# EAGLE design manual-switch (EAGLE 7.6.0)
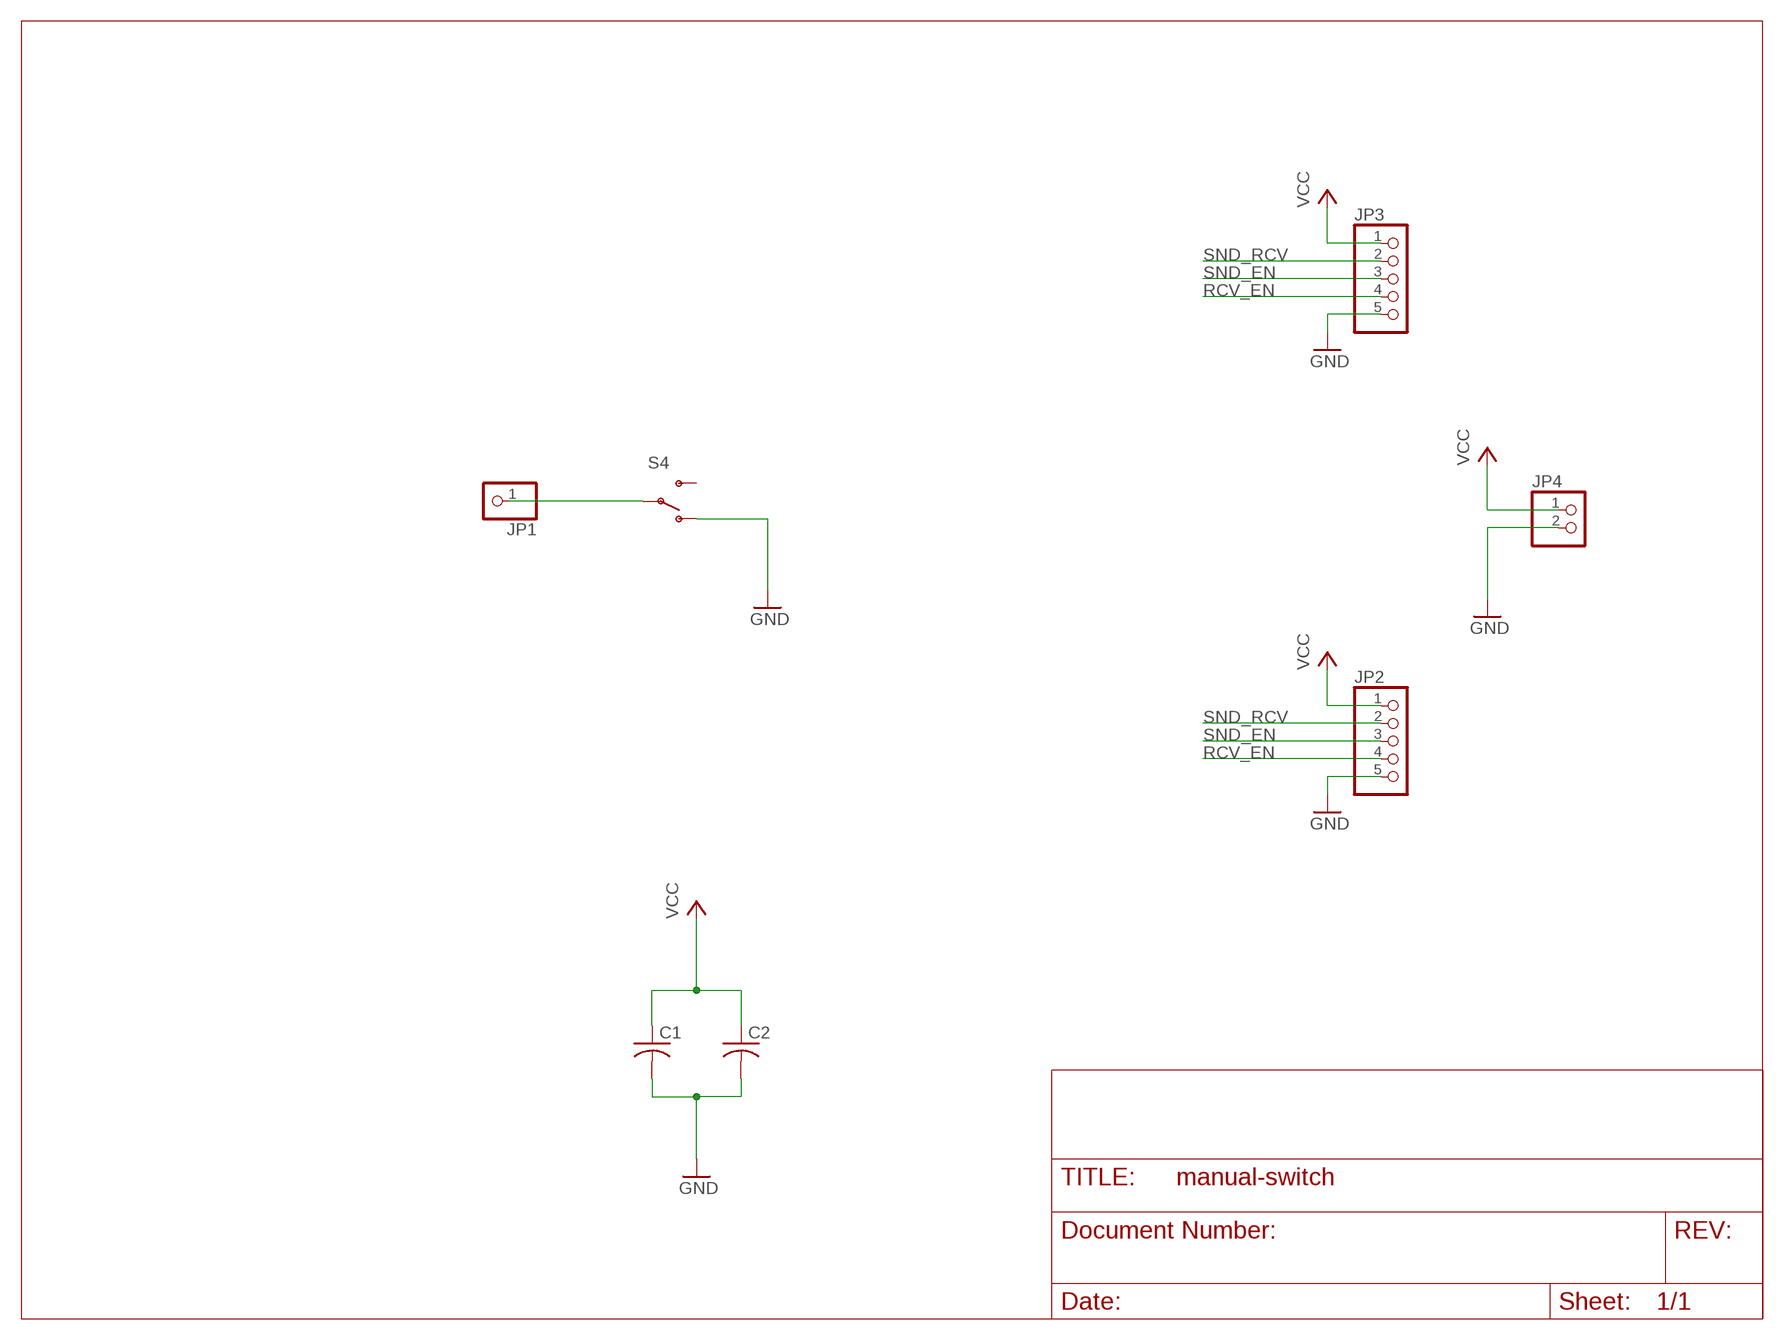
[diagram p0: schematic, sheet 1]

## Parts
C1  C-USC0805  [C0805]
C2  C-USC0805  [C0805]
JP1  PINHD-1X1  [1X01]
JP2  PINHD-1X5  [1X05]
JP3  PINHD-1X5  [1X05]
JP4  PINHD-1X2  [1X02]
S4  SWITCH-SPDTPTH  [SWITCH-SPDT]

## Nets
GND: C1.2 C2.2 JP2.5 JP3.5 JP4.2 S4.1(O)
N$1: JP1.1 S4.2(P)
RCV_EN: JP2.4 JP3.4
SND_EN: JP2.3 JP3.3
SND_RCV: JP2.2 JP3.2
VCC: C1.1 C2.1 JP2.1 JP3.1 JP4.1
Unconnected: S4.3(S)

## Library data of the parts
C1 C2 = resistor:C-US: CAPACITOR, American symbol
JP1 = pinhead:PINHD-1X1: PIN HEADER
JP2 JP3 = pinhead:PINHD-1X5: PIN HEADER
JP4 = pinhead:PINHD-1X2: PIN HEADER
S4 = SparkFun-Electromechanical:SWITCH-SPDT: SPDT Switch Simple slide switch, Spark Fun Electronics SKU : COM-00102 DPDT SMT slide switch, AYZ0202, SWCH-08179

## Board
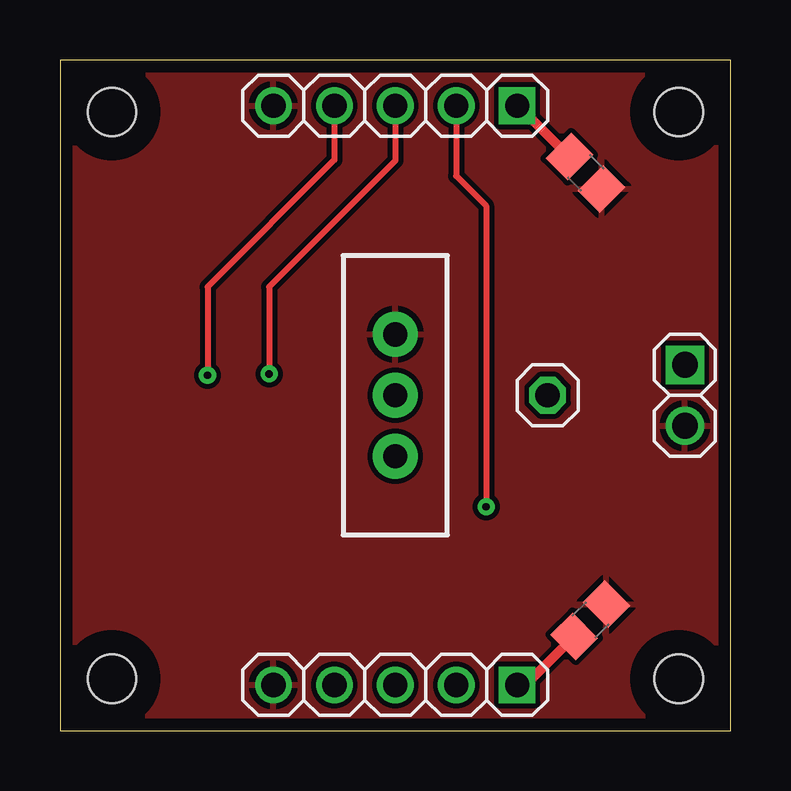
[diagram p1: board, top side]
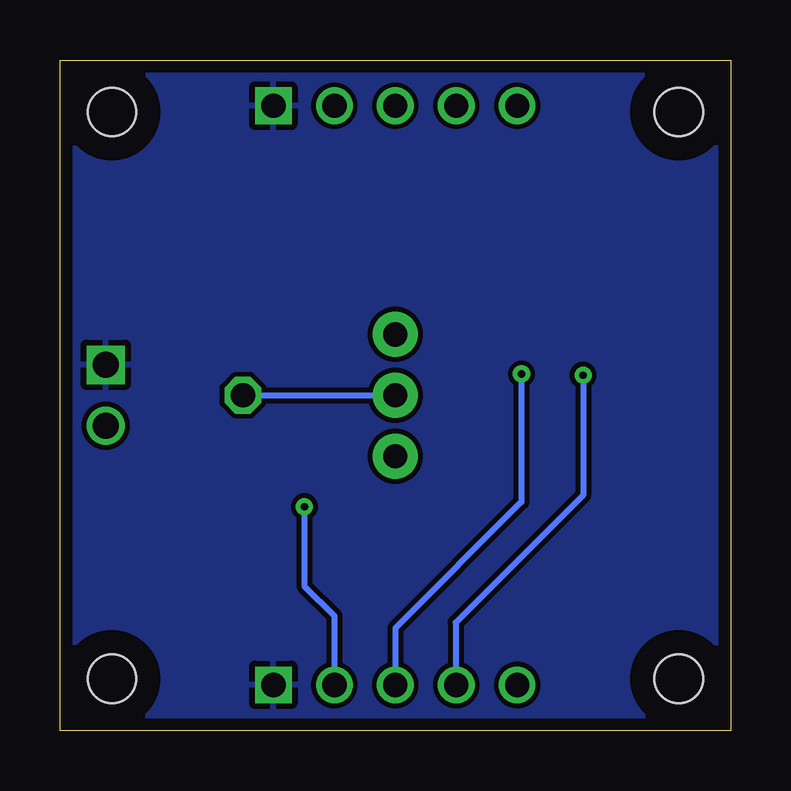
[diagram p2: board, bottom side, seen from below]

Size 27.94 x 27.94 mm. Coordinates in mm from the lower left corner, seen from the top.
Outline: 27.94,0 27.94,27.94 0,27.94 0,0 27.94,0
Copper layers (1*16): Top 0.035mm / dielectric 1.5mm / Bottom 0.035mm
Design rules "default *": minimum track width 8mil, minimum drill 12mil, track to track 8mil, track to pad 8mil, pad to pad 8mil, via to via 8mil, smd to smd 8mil, copper to edge 20mil, drill to drill 8mil, minimum pad ring 10mil, minimum via ring 8mil, stop-mask expansion 4mil, vias tented up to drill 0mil, thermal gap 10mil
Holes 2.01 mm at 2.16,25.78 2.16,2.16 25.78,2.16 25.78,25.78
tRestrict: area 0.2,0.2 to 4.2,4.2; area 23.8,0.2 to 27.8,4.2; area 23.8,23.8 to 27.8,27.8; area 0.2,23.8 to 4.2,27.8
bRestrict: area 0.2,0.2 to 4.2,4.2; area 23.8,0.2 to 27.8,4.2; area 23.8,23.8 to 27.8,27.8; area 0.2,23.8 to 4.2,27.8

### Footprints (pad centres in the part's own frame; a part is rotated, then mirrored left to right if it is on the bottom)
C0805 = smd 1.3 x 1.5: 1 -0.95,0; 2 0.95,0
1X01 = drill 1.016 octagon: 1 0,0
1X05 = drill 1.016 square: 1 -5.08,0 | drill 1.016: 2 -2.54,0; 3 0,0; 4 2.54,0; 5 5.08,0
1X02 = drill 1.067 square: 1 -1.27,0 | drill 1.067: 2 1.27,0
SWITCH-SPDT = drill 1.016 pad 1.88: 1 0,2.54; 2 0,0; 3 0,-2.54

### Placement (x,y rotation side)
C1  21.89,23.24 315 top
C2  22.1,4.6 45 top
JP1  20.32,13.97 0 top
JP2  13.97,1.91 180 top
JP3  13.97,26.04 180 top
JP4  26.04,13.97 270 top
S4  13.97,13.97 0 top

### Tracks (layer width: path | path; a pad name or v marks a point on that pad's centre or on a via)
GND
  pour Top: 0.25,0.25 0.25,27.69 27.69,27.69 27.69,0.25
N$1
  Bottom 0.254: JP1.1 S4.2
RCV_EN  (via drill 0.3)
  Top 0.254: JP3.4 11.43,23.77 6.15,18.49 v6.15,14.81
  Bottom 0.254: v6.15,14.81 6.15,9.8 11.46,4.5 11.46,1.93 JP2.4
SND_EN  (via drill 0.3)
  Top 0.254: JP3.3 13.97,23.75 8.71,18.49 v8.71,14.86
  Bottom 0.254: v8.71,14.86 8.71,9.53 13.97,4.27 JP2.3
SND_RCV  (via drill 0.3)
  Top 0.254: JP3.2 16.51,23.11 17.75,21.87 v17.75,9.32
  Bottom 0.254: v17.75,9.32 17.75,6.02 16.51,4.78 JP2.2
VCC
  Top 0.406: JP2.1 19.41,1.91 C2.1 | JP3.1 19.1,26.04 C1.1
  pour Bottom: 0.25,27.69 0.25,0.25 27.69,0.25 27.69,27.69